# Altium schematic sheet TowerSystemModuleTemplate.SchDoc: [SheetTitle]
size B; Date: [Date]
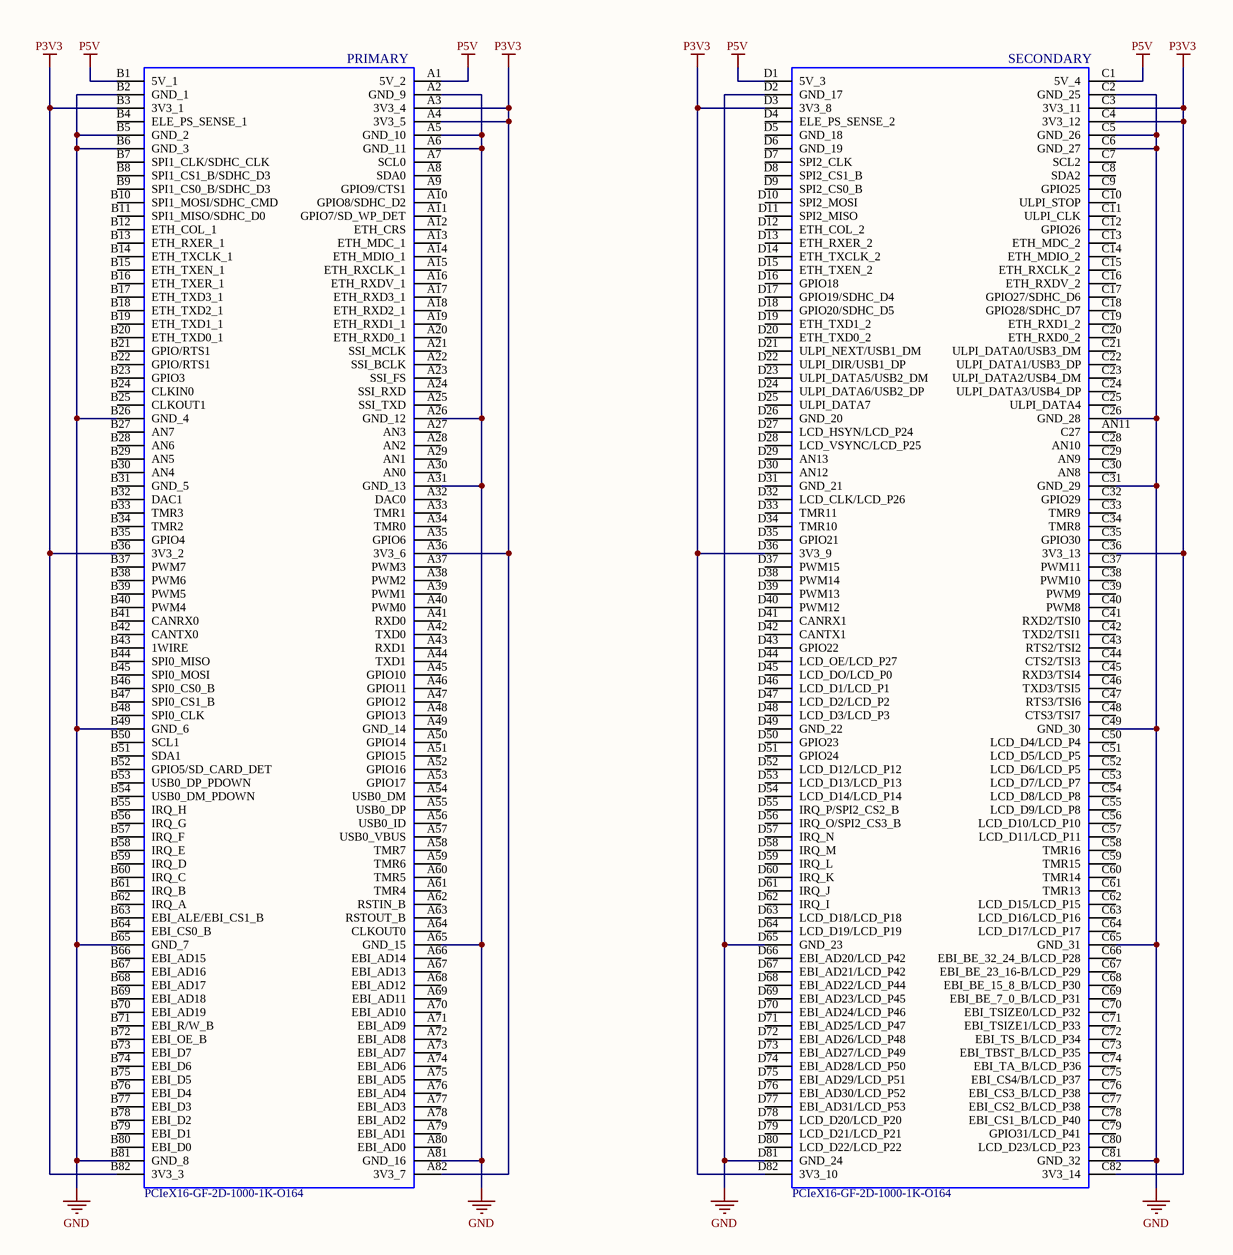
[diagram p0: TowerSystemModuleTemplate.SchDoc]

## Parts
P1  PCIeX16-GF-2D-1000-1K-O164  [TWR-PRIMARY-PCIeX16-GF-2D-1000-1K-O164]  (no BOM)
P2  PCIeX16-GF-2D-1000-1K-O164  [TWR-SECONDARY-PCIeX16-GF-2D-1000-1K-O164 - duplicate]  (no BOM)

## Nets
GND: P1.A2(GND_9) P1.A5(GND_10) P1.A6(GND_11) P1.A26(GND_12) P1.A31(GND_13) P1.A65(GND_15) P1.A81(GND_16) P1.B2(GND_1) P1.B5(GND_2) P1.B6(GND_3) P1.B26(GND_4) P1.B49(GND_6) P1.B65(GND_7) P1.B81(GND_8) P2.C2(GND_25) P2.C5(GND_26) P2.C6(GND_27) P2.C26(GND_28) P2.C31(GND_29) P2.C49(GND_30) P2.C65(GND_31) P2.C81(GND_32) P2.D2(GND_17) P2.D65(GND_23) P2.D81(GND_24)
P3V3: P1.A3(3V3_4) P1.A4(3V3_5) P1.A36(3V3_6) P1.A82(3V3_7) P1.B3(3V3_1) P1.B36(3V3_2) P1.B82(3V3_3) P2.C3(3V3_11) P2.C4(3V3_12) P2.C36(3V3_13) P2.C82(3V3_14) P2.D3(3V3_8) P2.D36(3V3_9) P2.D82(3V3_10)
P5V: P1.A1(5V_2) P1.B1(5V_1) P2.C1(5V_4) P2.D1(5V_3)

Not connected (* = marked no-connect by the designer): P1 A7(SCL0) A8(SDA0) A9(GPIO9/CTS1) A10(GPIO8/SDHC_D2) A11(GPIO7/SD_WP_DET) A12(ETH_CRS) A13(ETH_MDC_1) A14(ETH_MDIO_1) A15(ETH_RXCLK_1) A16(ETH_RXDV_1) A17(ETH_RXD3_1) A18(ETH_RXD2_1) A19(ETH_RXD1_1) A20(ETH_RXD0_1) A21(SSI_MCLK) A22(SSI_BCLK) A23(SSI_FS) A24(SSI_RXD) A25(SSI_TXD) A27(AN3) A28(AN2) A29(AN1) A30(AN0) A32(DAC0) A33(TMR1) A34(TMR0) A35(GPIO6) A37(PWM3) A38(PWM2) A39(PWM1) A40(PWM0) A41(RXD0) A42(TXD0) A43(RXD1) A44(TXD1) A45(GPIO10) A46(GPIO11) A47(GPIO12) A48(GPIO13) A49(GND_14) A50(GPIO14) A51(GPIO15) A52(GPIO16) A53(GPIO17) A54(USB0_DM) A55(USB0_DP) A56(USB0_ID) A57(USB0_VBUS) A58(TMR7) A59(TMR6) A60(TMR5) A61(TMR4) A62(RSTIN_B) A63(RSTOUT_B) A64(CLKOUT0) A66(EBI_AD14) A67(EBI_AD13) A68(EBI_AD12) A69(EBI_AD11) A70(EBI_AD10) A71(EBI_AD9) A72(EBI_AD8) A73(EBI_AD7) A74(EBI_AD6) A75(EBI_AD5) A76(EBI_AD4) A77(EBI_AD3) A78(EBI_AD2) A79(EBI_AD1) A80(EBI_AD0) B4(ELE_PS_SENSE_1) B7(SPI1_CLK/SDHC_CLK) B8(SPI1_CS1_B/SDHC_D3) B9(SPI1_CS0_B/SDHC_D3) B10(SPI1_MOSI/SDHC_CMD) B11(SPI1_MISO/SDHC_D0) B12(ETH_COL_1) B13(ETH_RXER_1) B14(ETH_TXCLK_1) B15(ETH_TXEN_1) B16(ETH_TXER_1) B17(ETH_TXD3_1) B18(ETH_TXD2_1) B19(ETH_TXD1_1) B20(ETH_TXD0_1) B21(GPIO/RTS1) B22(GPIO/RTS1) B23(GPIO3) B24(CLKIN0) B25(CLKOUT1) B27(AN7) B28(AN6) B29(AN5) B30(AN4) B31(GND_5) B32(DAC1) B33(TMR3) B34(TMR2) B35(GPIO4) B37(PWM7) B38(PWM6) B39(PWM5) B40(PWM4) B41(CANRX0) B42(CANTX0) B43(1WIRE) B44(SPI0_MISO) B45(SPI0_MOSI) B46(SPI0_CS0_B) B47(SPI0_CS1_B) B48(SPI0_CLK) B50(SCL1) B51(SDA1) B52(GPIO5/SD_CARD_DET) B53(USB0_DP_PDOWN) B54(USB0_DM_PDOWN) B55(IRQ_H) B56(IRQ_G) B57(IRQ_F) B58(IRQ_E) B59(IRQ_D) B60(IRQ_C) B61(IRQ_B) B62(IRQ_A) B63(EBI_ALE/EBI_CS1_B) B64(EBI_CS0_B) B66(EBI_AD15) B67(EBI_AD16) B68(EBI_AD17) B69(EBI_AD18) B70(EBI_AD19) B71(EBI_R/W_B) B72(EBI_OE_B) B73(EBI_D7) B74(EBI_D6) B75(EBI_D5) B76(EBI_D4) B77(EBI_D3) B78(EBI_D2) B79(EBI_D1) B80(EBI_D0); P2 AN11(C27) C7(SCL2) C8(SDA2) C9(GPIO25) C10(ULPI_STOP) C11(ULPI_CLK) C12(GPIO26) C13(ETH_MDC_2) C14(ETH_MDIO_2) C15(ETH_RXCLK_2) C16(ETH_RXDV_2) C17(GPIO27/SDHC_D6) C18(GPIO28/SDHC_D7) C19(ETH_RXD1_2) C20(ETH_RXD0_2) C21(ULPI_DATA0/USB3_DM) C22(ULPI_DATA1/USB3_DP) C23(ULPI_DATA2/USB4_DM) C24(ULPI_DATA3/USB4_DP) C25(ULPI_DATA4) C28(AN10) C29(AN9) C30(AN8) C32(GPIO29) C33(TMR9) C34(TMR8) C35(GPIO30) C37(PWM11) C38(PWM10) C39(PWM9) C40(PWM8) C41(RXD2/TSI0) C42(TXD2/TSI1) C43(RTS2/TSI2) C44(CTS2/TSI3) C45(RXD3/TSI4) C46(TXD3/TSI5) C47(RTS3/TSI6) C48(CTS3/TSI7) C50(LCD_D4/LCD_P4) C51(LCD_D5/LCD_P5) C52(LCD_D6/LCD_P5) C53(LCD_D7/LCD_P7) C54(LCD_D8/LCD_P8) C55(LCD_D9/LCD_P8) C56(LCD_D10/LCD_P10) C57(LCD_D11/LCD_P11) C58(TMR16) C59(TMR15) C60(TMR14) C61(TMR13) C62(LCD_D15/LCD_P15) C63(LCD_D16/LCD_P16) C64(LCD_D17/LCD_P17) C66(EBI_BE_32_24_B/LCD_P28) C67(EBI_BE_23_16-B/LCD_P29) C68(EBI_BE_15_8_B/LCD_P30) C69(EBI_BE_7_0_B/LCD_P31) C70(EBI_TSIZE0/LCD_P32) C71(EBI_TSIZE1/LCD_P33) C72(EBI_TS_B/LCD_P34) C73(EBI_TBST_B/LCD_P35) C74(EBI_TA_B/LCD_P36) C75(EBI_CS4/B/LCD_P37) C76(EBI_CS3_B/LCD_P38) C77(EBI_CS2_B/LCD_P38) C78(EBI_CS1_B/LCD_P40) C79(GPIO31/LCD_P41) C80(LCD_D23/LCD_P23) D4(ELE_PS_SENSE_2) D5(GND_18) D6(GND_19) D7(SPI2_CLK) D8(SPI2_CS1_B) D9(SPI2_CS0_B) D10(SPI2_MOSI) D11(SPI2_MISO) D12(ETH_COL_2) D13(ETH_RXER_2) D14(ETH_TXCLK_2) D15(ETH_TXEN_2) D16(GPIO18) D17(GPIO19/SDHC_D4) D18(GPIO20/SDHC_D5) D19(ETH_TXD1_2) D20(ETH_TXD0_2) D21(ULPI_NEXT/USB1_DM) D22(ULPI_DIR/USB1_DP) D23(ULPI_DATA5/USB2_DM) D24(ULPI_DATA6/USB2_DP) D25(ULPI_DATA7) D26(GND_20) D27(LCD_HSYN/LCD_P24) D28(LCD_VSYNC/LCD_P25) D29(AN13) D30(AN12) D31(GND_21) D32(LCD_CLK/LCD_P26) D33(TMR11) D34(TMR10) D35(GPIO21) D37(PWM15) D38(PWM14) D39(PWM13) D40(PWM12) D41(CANRX1) D42(CANTX1) D43(GPIO22) D44(LCD_OE/LCD_P27) D45(LCD_DO/LCD_P0) D46(LCD_D1/LCD_P1) D47(LCD_D2/LCD_P2) D48(LCD_D3/LCD_P3) D49(GND_22) D50(GPIO23) D51(GPIO24) D52(LCD_D12/LCD_P12) D53(LCD_D13/LCD_P13) D54(LCD_D14/LCD_P14) D55(IRQ_P/SPI2_CS2_B) D56(IRQ_O/SPI2_CS3_B) D57(IRQ_N) D58(IRQ_M) D59(IRQ_L) D60(IRQ_K) D61(IRQ_J) D62(IRQ_I) D63(LCD_D18/LCD_P18) D64(LCD_D19/LCD_P19) D66(EBI_AD20/LCD_P42) D67(EBI_AD21/LCD_P42) D68(EBI_AD22/LCD_P44) D69(EBI_AD23/LCD_P45) D70(EBI_AD24/LCD_P46) D71(EBI_AD25/LCD_P47) D72(EBI_AD26/LCD_P48) D73(EBI_AD27/LCD_P49) D74(EBI_AD28/LCD_P50) D75(EBI_AD29/LCD_P51) D76(EBI_AD30/LCD_P52) D77(EBI_AD31/LCD_P53) D78(LCD_D20/LCD_P20) D79(LCD_D21/LCD_P21) D80(LCD_D22/LCD_P22)

## Notes on the sheet
- Sheet Title:
- Project Title:
- Engineer:
- Draftsman:
- Date:
- Size:
- B
- Revision:
- Sheet:        of
- (in symbol TWR-PRIMARY-PCIeX16-GF-2D-1000-1K-O164) PRIMARY
- (in symbol TWR-SECONDARY-PCIeX16-GF-2D-1000-1K-O164) SECONDARY

## Library data of the parts
P1 = TWR-PRIMARY-PCIeX16-GF-2D-1000-1K-O164: Golden finger, PCIeX16, Dual, Opposite, Pitch 1mm, 164-Position; ClassName: Edge Connector
P2 = TWR-SECONDARY-PCIeX16-GF-2D-1000-1K-O164: Golden finger, PCIeX16, Dual, Opposite, Pitch 1mm, 164-Position; ClassName: Edge Connector